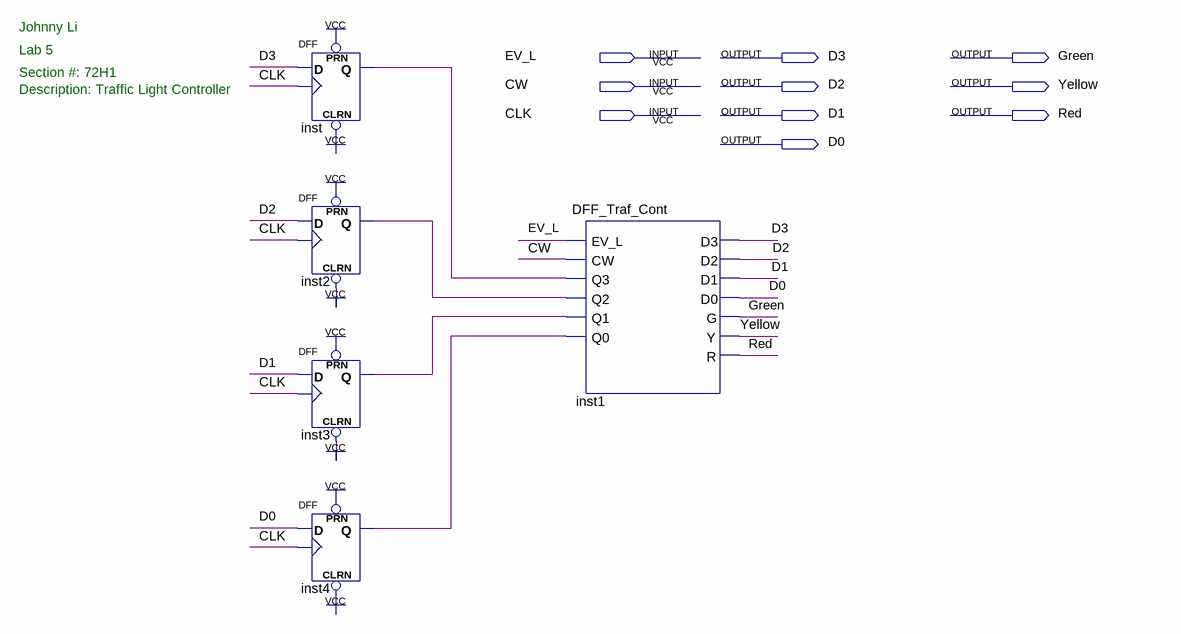
[diagram p0: schematic sheet]
// Quartus schematic Lab5_DFF_Traf_Cont.bdf as structural Verilog: 5 symbols, 10 pins
module Lab5_DFF_Traf_Cont (
  input  EV_L,
  input  CW,
  input  CLK,
  output D3,
  output Green,
  output D2,
  output Yellow,
  output D1,
  output Red,
  output D0
);

  wire inst2_q, inst3_q, inst4_q, inst_q;

  DFF inst (.CLRN(1'b1), .CLK(CLK), .D(D3), .PRN(1'b1), .Q(inst_q));
  DFF inst2 (.CLRN(1'b1), .CLK(CLK), .D(D2), .PRN(1'b1), .Q(inst2_q));
  DFF inst3 (.CLRN(1'b1), .CLK(CLK), .D(D1), .PRN(1'b1), .Q(inst3_q));
  DFF inst4 (.CLRN(1'b1), .CLK(CLK), .D(D0), .PRN(1'b1), .Q(inst4_q));
  DFF_Traf_Cont inst1 (
    .EV_L(EV_L), .CW(CW), .Q3(inst_q), .Q2(inst2_q), .Q1(inst3_q), .Q0(inst4_q), .D3(D3), .D2(D2), .D1(D1),
    .D0(D0), .G(Green), .Y(Yellow), .R(Red));

  // Notes on the sheet:
  //   Johnny Li 
  //   Lab 5 
  //   Section #: 72H1
  //   Description: Traffic Light Controller
endmodule
